# Altium schematic sheet 1_Interface.SchDoc: DB_ADCS Interface
size A3; DrawnBy: Augusto Cezar Boldori Vassoler; Revision: V1.0; SheetNumber: 1; SheetTotal: 6; Project: DB_ADCS.PrjPCB
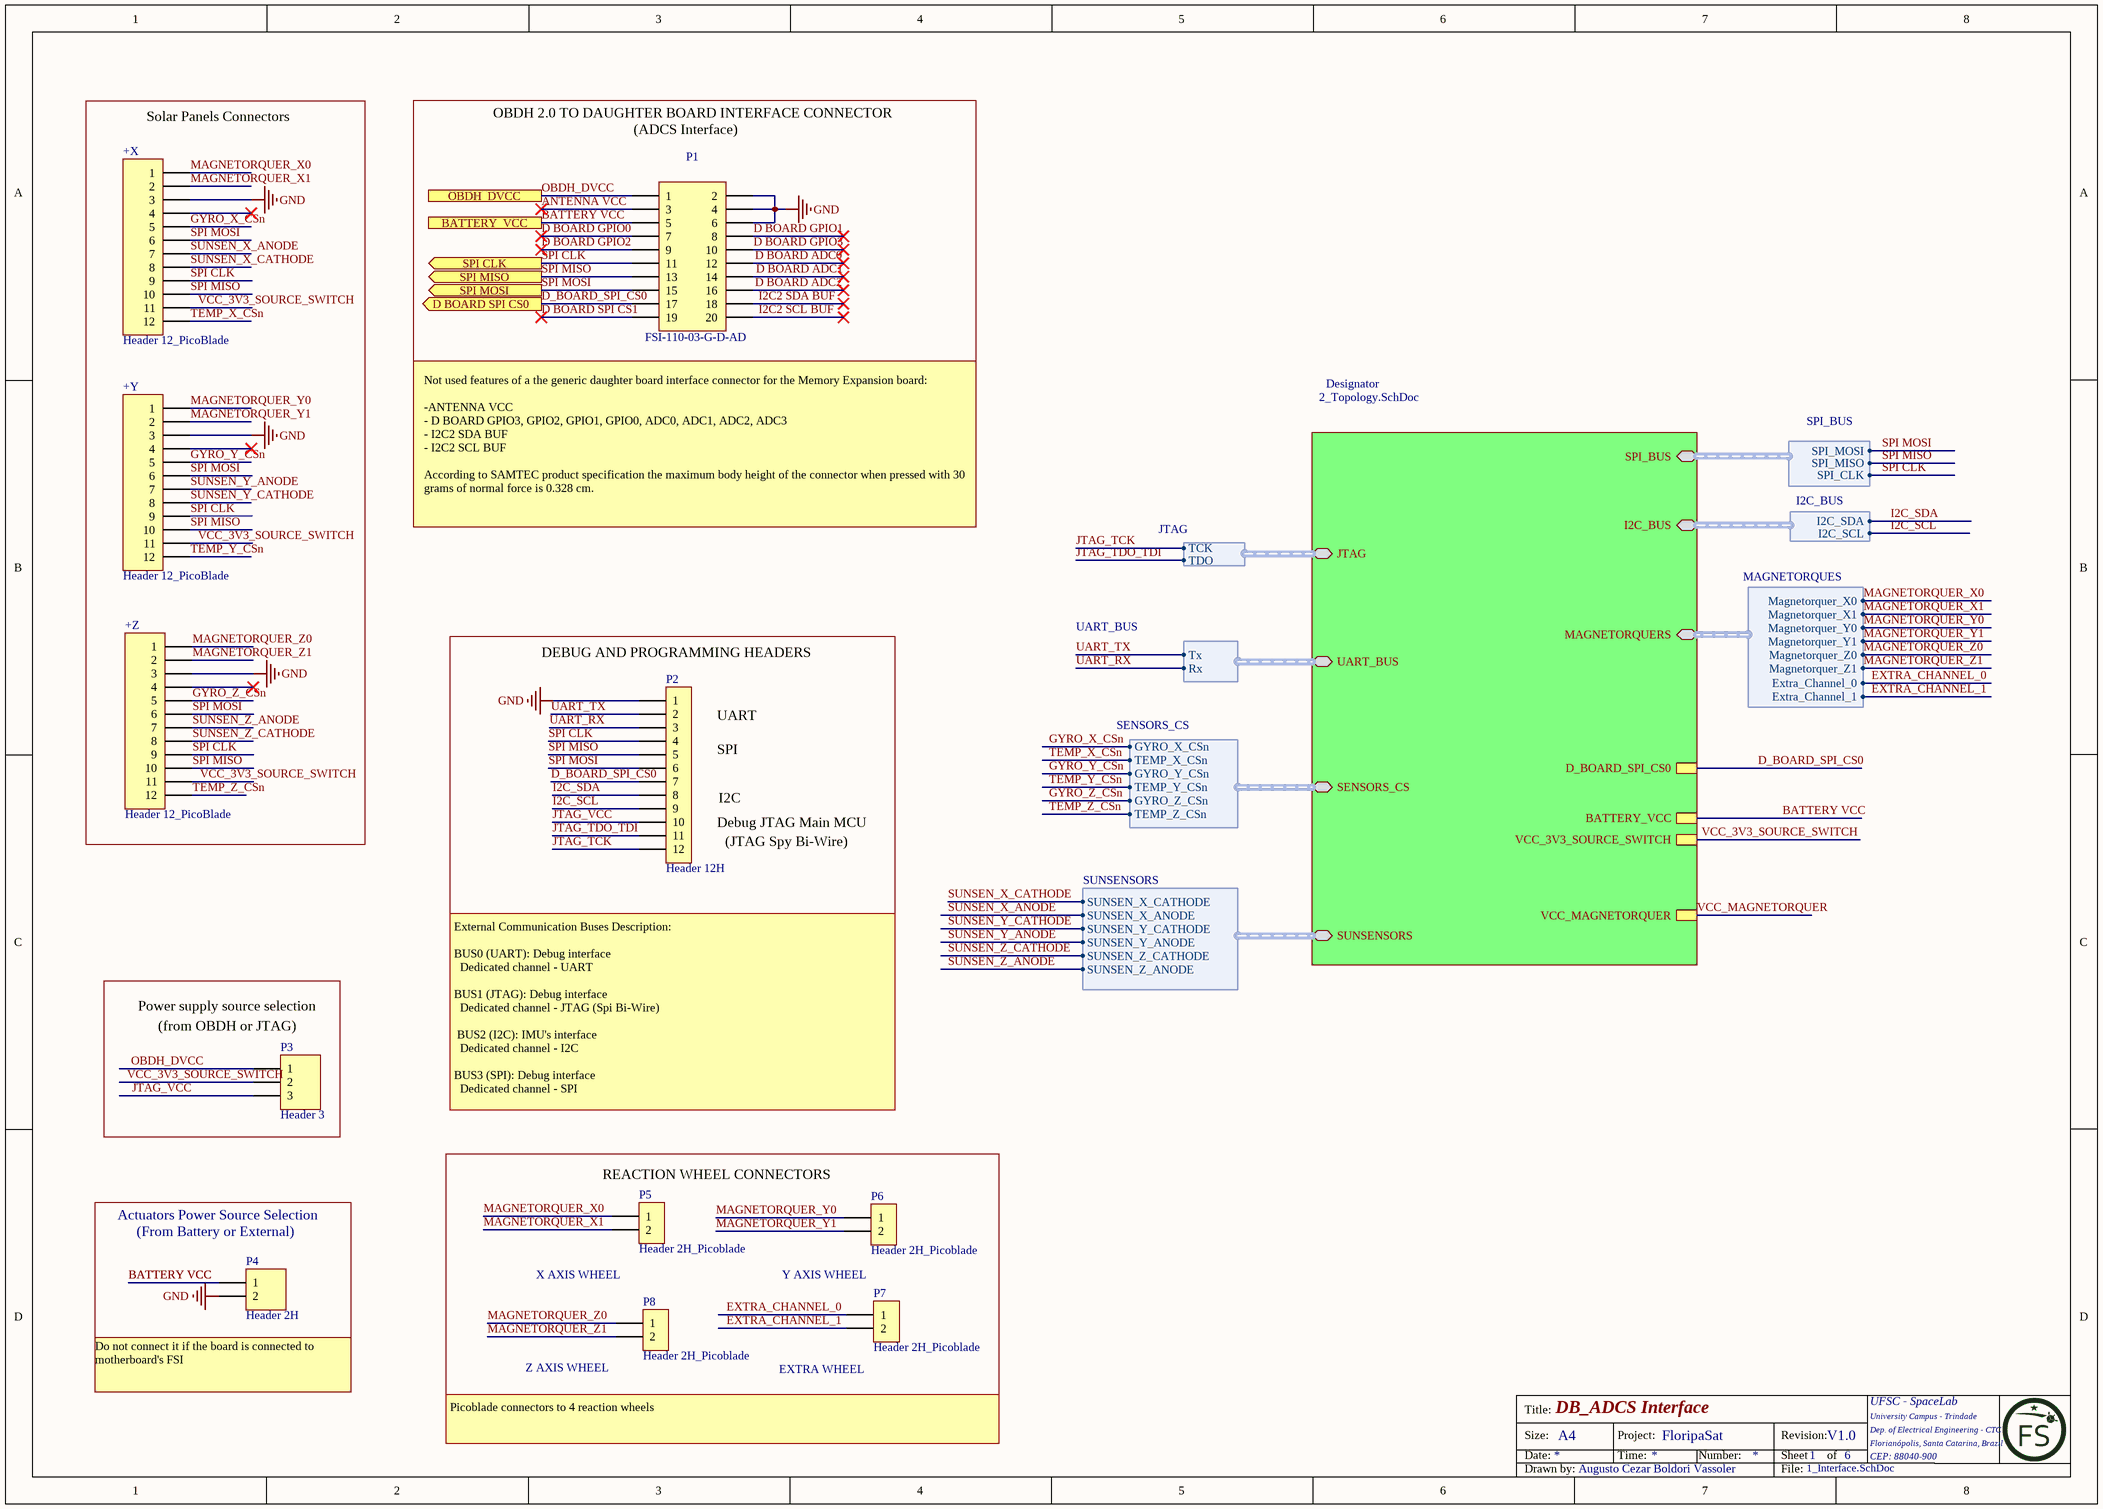
[diagram p0: 1_Interface.SchDoc]

## Parts
+X  Header 12_PicoBlade  [HDR12 PicoBlade - duplicate]
+Y  Header 12_PicoBlade  [HDR12 PicoBlade - duplicate]
+Z  Header 12_PicoBlade  [HDR12 PicoBlade - duplicate]
P1  FSI-110-03-G-D-AD  [Mating FSI-110-03-G-D-AD]
P2  Header 12H  [61301211021]
P3  Header 3  [HDR1X3]
P4  Header 2H  [HDR1X2H]
P5  Header 2H_Picoblade  [HDR2 PICOBLADE]
P6  Header 2H_Picoblade  [HDR2 PICOBLADE]
P7  Header 2H_Picoblade  [HDR2 PICOBLADE]
P8  Header 2H_Picoblade  [HDR2 PICOBLADE]

## Blocks framed on the sheet
Solar Panels Connectors: +X +Y +Z
REACTION WHEEL CONNECTORS: P5-P8

## Sub-sheets
Designator = 2_Topology.SchDoc: JTAG (bidir, harness JTAG), UART_BUS (bidir, harness UART_BUS), SENSORS_CS (bidir, harness SENSORS_CS), SUNSENSORS (bidir, harness SUNSENSORS), MAGNETORQUERS (bidir, harness MAGNETORQUES), BATTERY_VCC, I2C_BUS (bidir, harness I2C_BUS), SPI_BUS (bidir, harness SPI_BUS), VCC_3V3_SOURCE_SWITCH, D_BOARD_SPI_CS0, VCC_MAGNETORQUER

## Ports
BATTERY_VCC, D BOARD SPI CS0 (out), OBDH_DVCC, SPI CLK (out), SPI MISO (out), SPI MOSI (out)

## Harnesses
JTAG: TDO, TCK
UART_BUS: Rx, Tx
SENSORS_CS: GYRO_X_CSn, TEMP_X_CSn, GYRO_Y_CSn, TEMP_Y_CSn, GYRO_Z_CSn, TEMP_Z_CSn
SUNSENSORS: SUNSEN_Z_ANODE, SUNSEN_Z_CATHODE, SUNSEN_Y_ANODE, SUNSEN_Y_CATHODE, SUNSEN_X_ANODE, SUNSEN_X_CATHODE
MAGNETORQUES: Magnetorquer_X0, Magnetorquer_X1, Magnetorquer_Y0, Magnetorquer_Y1, Magnetorquer_Z0, Magnetorquer_Z1, Extra_Channel_0, Extra_Channel_1
I2C_BUS: I2C_SDA, I2C_SCL
SPI_BUS: SPI_CLK, SPI_MISO, SPI_MOSI

## Nets
GND: +X.3 +Y.3 +Z.3 P1.2 P1.4 P1.6 P2.1 P4.2
ANTENNA VCC: P1.3
BATTERY VCC: P1.5 P4.1 ; port BATTERY_VCC, sheet Designator/BATTERY_VCC
D BOARD ADC0: P1.12
D BOARD ADC1: P1.14
D BOARD ADC2: P1.16
D BOARD GPIO0: P1.7
D BOARD GPIO1: P1.8
D BOARD GPIO2: P1.9
D BOARD GPIO3: P1.10
D BOARD SPI CS1: P1.19
D_BOARD_SPI_CS0: P1.17 P2.7 ; port D BOARD SPI CS0, sheet Designator/D_BOARD_SPI_CS0
EXTRA_CHANNEL_0: P7.1 ; sheet Designator/MAGNETORQUERS.Extra_Channel_0
EXTRA_CHANNEL_1: P7.2 ; sheet Designator/MAGNETORQUERS.Extra_Channel_1
GYRO_X_CSn: +X.5 ; sheet Designator/SENSORS_CS.GYRO_X_CSn
GYRO_Y_CSn: +Y.5 ; sheet Designator/SENSORS_CS.GYRO_Y_CSn
GYRO_Z_CSn: +Z.5 ; sheet Designator/SENSORS_CS.GYRO_Z_CSn
I2C2 SCL BUF: P1.20
I2C2 SDA BUF: P1.18
I2C_SCL: P2.9 ; sheet Designator/I2C_BUS.I2C_SCL
I2C_SDA: P2.8 ; sheet Designator/I2C_BUS.I2C_SDA
JTAG_TCK: P2.12 ; sheet Designator/JTAG.TCK
JTAG_TDO_TDI: P2.11 ; sheet Designator/JTAG.TDO
JTAG_VCC: P2.10 P3.3
MAGNETORQUER_X0: +X.1 P5.1 ; sheet Designator/MAGNETORQUERS.Magnetorquer_X0
MAGNETORQUER_X1: +X.2 P5.2 ; sheet Designator/MAGNETORQUERS.Magnetorquer_X1
MAGNETORQUER_Y0: +Y.1 P6.1 ; sheet Designator/MAGNETORQUERS.Magnetorquer_Y0
MAGNETORQUER_Y1: +Y.2 P6.2 ; sheet Designator/MAGNETORQUERS.Magnetorquer_Y1
MAGNETORQUER_Z0: +Z.1 P8.1 ; sheet Designator/MAGNETORQUERS.Magnetorquer_Z0
MAGNETORQUER_Z1: +Z.2 P8.2 ; sheet Designator/MAGNETORQUERS.Magnetorquer_Z1
OBDH_DVCC: P1.1 P3.1 ; port OBDH_DVCC
SPI CLK: +X.9 +Y.9 +Z.9 P1.11 P2.4 ; port SPI CLK, sheet Designator/SPI_BUS.SPI_CLK
SPI MISO: +X.10 +Y.10 +Z.10 P1.13 P2.5 ; port SPI MISO, sheet Designator/SPI_BUS.SPI_MISO
SPI MOSI: +X.6 +Y.6 +Z.6 P1.15 P2.6 ; port SPI MOSI, sheet Designator/SPI_BUS.SPI_MOSI
SUNSEN_X_ANODE: +X.7 ; sheet Designator/SUNSENSORS.SUNSEN_X_ANODE
SUNSEN_X_CATHODE: +X.8 ; sheet Designator/SUNSENSORS.SUNSEN_X_CATHODE
SUNSEN_Y_ANODE: +Y.7 ; sheet Designator/SUNSENSORS.SUNSEN_Y_ANODE
SUNSEN_Y_CATHODE: +Y.8 ; sheet Designator/SUNSENSORS.SUNSEN_Y_CATHODE
SUNSEN_Z_ANODE: +Z.7 ; sheet Designator/SUNSENSORS.SUNSEN_Z_ANODE
SUNSEN_Z_CATHODE: +Z.8 ; sheet Designator/SUNSENSORS.SUNSEN_Z_CATHODE
TEMP_X_CSn: +X.12 ; sheet Designator/SENSORS_CS.TEMP_X_CSn
TEMP_Y_CSn: +Y.12 ; sheet Designator/SENSORS_CS.TEMP_Y_CSn
TEMP_Z_CSn: +Z.12 ; sheet Designator/SENSORS_CS.TEMP_Z_CSn
UART_RX: P2.3 ; sheet Designator/UART_BUS.Rx
UART_TX: P2.2 ; sheet Designator/UART_BUS.Tx
VCC_3V3_SOURCE_SWITCH: +X.11 +Y.11 +Z.11 P3.2 ; sheet Designator/VCC_3V3_SOURCE_SWITCH
VCC_MAGNETORQUER: sheet Designator/VCC_MAGNETORQUER

Not connected (* = marked no-connect by the designer): +X 4*; +Y 4*; +Z 4*

## Notes on the sheet
- OBDH 2.0 TO DAUGHTER BOARD INTERFACE CONNECTOR
- (ADCS Interface)
- Not used features of a the generic daughter board interface connector for the Memory Expansion board:
  -ANTENNA VCC
  - D BOARD GPIO3, GPIO2, GPIO1, GPIO0, ADC0, ADC1, ADC2, ADC3
  - I2C2 SDA BUF
  - I2C2 SCL BUF
  According to SAMTEC product specification the maximum body height of the connector when pressed with 30 grams of normal force is 0.328 cm.
- (near P2) DEBUG AND PROGRAMMING HEADERS
- (near P2) UART
- (near P2) SPI
- (near P2) Debug JTAG Main MCU
- (near P2) I2C
- (JTAG Spy Bi-Wire)
- (near P3) Power supply source selection
- (near P3) (from OBDH or JTAG)
- External Communication Buses Description:
  BUS0 (UART): Debug interface
  Dedicated channel - UART
  BUS1 (JTAG): Debug interface
  Dedicated channel - JTAG (Spi Bi-Wire)
  BUS2 (I2C): IMU's interface
  Dedicated channel - I2C
  BUS3 (SPI): Debug interface
  Dedicated channel - SPI
- Actuators Power Source Selection
- (near P4) (From Battery or External)
- X AXIS WHEEL
- Y AXIS WHEEL
- (near P4) Do not connect it if the board is connected to motherboard's FSI
- (near P8) Z AXIS WHEEL
- (near P7) EXTRA WHEEL
- Picoblade connectors to 4 reaction wheels
- Title:
- Size:
- Date:
- A4
- Project:
- Time:
- FloripaSat
- Number:
- Revision:
- Sheet
- of
- UFSC - SpaceLab
- University Campus - Trindade
- Dep. of Electrical Engineering - CTC
- Florianópolis, Santa Catarina, Brazil
- CEP: 88040-900
- Drawn by:
- File:

## Library data of the parts
+X +Y = Header 12_PicoBlade: Header, 12-Pin; PartNumber: 53398-1271; LatestRevisionDate: 17-Jul-2002; LatestRevisionNote: Re-released for DXP Platform.; Publisher: Altium Limited
+Z = Header 12_PicoBlade: Header, 12-Pin; PartNumber: 533981271; LatestRevisionDate: 17-Jul-2002; LatestRevisionNote: Re-released for DXP Platform.; Publisher: Altium Limited
P1 = FSI-110-03-G-D-AD: CONN STACKING 20POS SMD GOLD; Manufacturer: Samtec; Gender: Male; Number of Contacts: 20; Pitch: 1mm; Value: *; Partnumber: FSI-110-03-G-D-AD; ComponentLink1Description: https://www.digikey.com/product-detail/en/samtec-inc/FSI-110-03-G-D-AD/SAM9412-ND/6678149; ComponentLink1URL: https://www.digikey.com/product-detail/en/samtec-inc/FSI-110-03-G-D-AD/SAM9412-ND/6678149; ComponentLink2Description: https://br.mouser.com/ProductDetail/Samtec/FSI-110-03-G-D-AD?qs=sGAEpiMZZMvffgRu4KC1RxM6nKwEP14AvPoIU%2FGiIRnIunfAN0MvNQ%3D%3D; ComponentLink2URL: https://br.mouser.com/ProductDetail/Samtec/FSI-110-03-G-D-AD?qs=sGAEpiMZZMvffgRu4KC1RxM6nKwEP14AvPoIU%2FGiIRnIunfAN0MvNQ%3D%3D; ComponentLink3Description: http://www.samtec.com/ftppub/pdf/FSI_03.PDF?src-supplier=Avnet+Europe; ComponentLink3URL: http://www.samtec.com/ftppub/pdf/FSI_03.PDF?src-supplier=Avnet+Europe; Contact Material: Copper; Contact Plating: Gold; Manufacturer Part Number: FSI-110-03-G-D-AD; Mount: Surface Mount; Number of Rows: 2; Pricing 1: 1=6.6, 10=6.325, 25=5.7752, 50=5.5, 100=5.225, 250=4.675, 500=4.4, 1000=3.85, 2500=3.6575 (USD); Pricing 2: 1=6.59, 10=5.5, 100=4.68, 250=4.17, 500=3.84, 1000=3.6 (USD); Radiation Hardening: No; REACH SVHC: No SVHC; Stock 1: 100; Stock 2: 50; Supplier 1: Digi-Key; Supplier 2: Mouser; Supplier Part Number 1: SAM9412-ND; Supplier Part Number 2: 200-FSI11003GDAD; Termination: Solder
P2 = Header 12H: Header, 12; Manufacturer: Wurth Electronics; Number of Contacts: 12; Gender: Male; Connector Type: Male Pin; Pitch: 0.1inch; Supplier 1: Digi-Key; Supplier Part Number 1: 732-5343-ND; Manufacturer Part Number: 61301211021; RoHS: Yes; Category: Connectors; Stock 1: 973; Pricing 1: 1=0,90000, 10=0,76600, 25=0,63920, 50=0,53200, 100=0,48400, 500=0,44000 (USD); Mount: Through Hole; Contact Material: Copper; Color: Black; Contact Plating: Gold; Number of Rows: 1; Termination: Solder; Packaging: Bulk; Number of Positions: 12; Contact Mating Length: 0.236inch; REACH SVHC: Unknown; ComponentLink1URL: http://www.farnell.com/datasheets/1442172.pdf?src-supplier=Farnell; ComponentLink1Description: http://www.farnell.com/datasheets/1442172.pdf?src-supplier=Farnell; ComponentLink2URL: http://www.farnell.com/datasheets/1442172.pdf?src-supplier=Element14; ComponentLink2Description: http://www.farnell.com/datasheets/1442172.pdf?src-supplier=Element14; ComponentLink3URL: https://katalog.we-online.de/em/datasheet/6130xx11021.pdf?src-supplier=Digi-Key; ComponentLink3Description: https://katalog.we-online.de/em/datasheet/6130xx11021.pdf?src-supplier=Digi-Key; ComponentLink4URL: http://www.farnell.com/datasheets/1442172.pdf?src-supplier=Newark; ComponentLink4Description: http://www.farnell.com/datasheets/1442172.pdf?src-supplier=Newark
P3 = Header 3: Header, 3-Pin; LatestRevisionDate: 17-Jul-2002; LatestRevisionNote: Re-released for DXP Platform.; Publisher: Altium Limited
P4 = Header 2H: Header, 2-Pin, Right Angle; LatestRevisionDate: 17-Jul-2002; LatestRevisionNote: Re-released for DXP Platform.; Publisher: Altium Limited
P5-P8 = Header 2H_Picoblade: Header,2-Pin,Right Angle; Manufacturer: Molex; Manufacturer Part Number: 53261-0271; Number of Positions: 2; Gender: Male; Current Rating: 1A; Voltage Rating: 125V; Contact Resistance: 20mR; Insulation Resistance: 100MR; Pitch: 1.25mm; Glow Wire Compliant: Non-compliant; Supplier 1: Digi-Key; Supplier Part Number 1: WM7620CT-ND; RoHS: Yes; Category: Headers and Wire Housings; Stock 1: 38296; Pricing 1: 1=0,51000, 10=0,48200, 100=0,36940, 500=0,32120 (USD); Mount: Surface Mount; Housing Material: Thermoplastic; Contact Material: Bronze,Tin; Color: Beige; Contact Plating: Tin; Min Operating Temperature: -40°C; Max Operating Temperature: 85°C; Termination: SMD/SMT; Packaging: Tape and Reel; Number of Rows: 1; Package Quantity: 1000; Orientation: Right Angle; Number of Contacts: 2; Number of Circuits: 2; Voltage Rating (DC): 125V; Voltage Rating (AC): 125V; Working Voltage: 125V; Lead Pitch: 1.25mm; Radiation Hardening: No; REACH SVHC: Unknown; Lead Free: Lead Free; Flammability Rating: UL94 V-0; ComponentLink1URL: https://datasheet.ciiva.com/11747/0900766b8078fc90-11747475.pdf?src-supplier=RSComponents; ComponentLink1Description: https://datasheet.ciiva.com/11747/0900766b8078fc90-11747475.pdf?src-supplier=RSComponents; ComponentLink2URL: https://datasheet.ciiva.com/7167/1626147-7167496.pdf?src-supplier=Newark; ComponentLink2Description: https://datasheet.ciiva.com/7167/1626147-7167496.pdf?src-supplier=Newark; ComponentLink3URL: https://datasheet.ciiva.com/30193/198270532610271-pcb-headers-30193321.pdf?src-supplier=Onlinecomponents.com; ComponentLink3Description: https://datasheet.ciiva.com/30193/198270532610271-pcb-headers-30193321.pdf?src-supplier=Onlinecomponents.com; ComponentLink4URL: https://datasheet.ciiva.com/5151/0532610271-pcb-headers-171053-5151611.pdf?src-supplier=Mouser; ComponentLink4Description: https://datasheet.ciiva.com/5151/0532610271-pcb-headers-171053-5151611.pdf?src-supplier=Mouser; ComponentLink5URL: https://datasheet.ciiva.com/34303/1932547-34303342.pdf?src-supplier=Jameco; ComponentLink5Description: https://datasheet.ciiva.com/34303/1932547-34303342.pdf?src-supplier=Jameco; ComponentLink6URL: https://datasheet.ciiva.com/16658/0532610271-pcb-headers-16658423.pdf?src-supplier=Avnet+Europe; ComponentLink6Description: https://datasheet.ciiva.com/16658/0532610271-pcb-headers-16658423.pdf?src-supplier=Avnet+Europe; ComponentLink7URL: https://datasheet.ciiva.com/17035/70091115-17035863.pdf?src-supplier=Allied+Electronics; ComponentLink7Description: https://datasheet.ciiva.com/17035/70091115-17035863.pdf?src-supplier=Allied+Electronics; ComponentLink8URL: https://datasheet.ciiva.com/7920/1887027-7920826.pdf?src-supplier=Element14; ComponentLink8Description: https://datasheet.ciiva.com/7920/1887027-7920826.pdf?src-supplier=Element14; ComponentLink9URL: https://datasheet.ciiva.com/9468/0532610271-pcb-headers-9468506.pdf?src-supplier=Avnet; ComponentLink9Description: https://datasheet.ciiva.com/9468/0532610271-pcb-headers-9468506.pdf?src-supplier=Avnet; ComponentLink10URL: https://datasheet.ciiva.com/22683/1626147-22683562.pdf?src-supplier=Element14; ComponentLink10Description: https://datasheet.ciiva.com/22683/1626147-22683562.pdf?src-supplier=Element14; ComponentLink11URL: https://datasheet.ciiva.com/46393/1808526-46393547.pdf?src-supplier=Element14; ComponentLink11Description: https://datasheet.ciiva.com/46393/1808526-46393547.pdf?src-supplier=Element14